# EasyEDA schematic SCH_pcb-try-1_2025-03-21.json
TITLE: Sheet_1; REV: 1.0; Date: 2025-03-08; Sheet: 1/1; Drawn By: amiragh; Company: Your Company
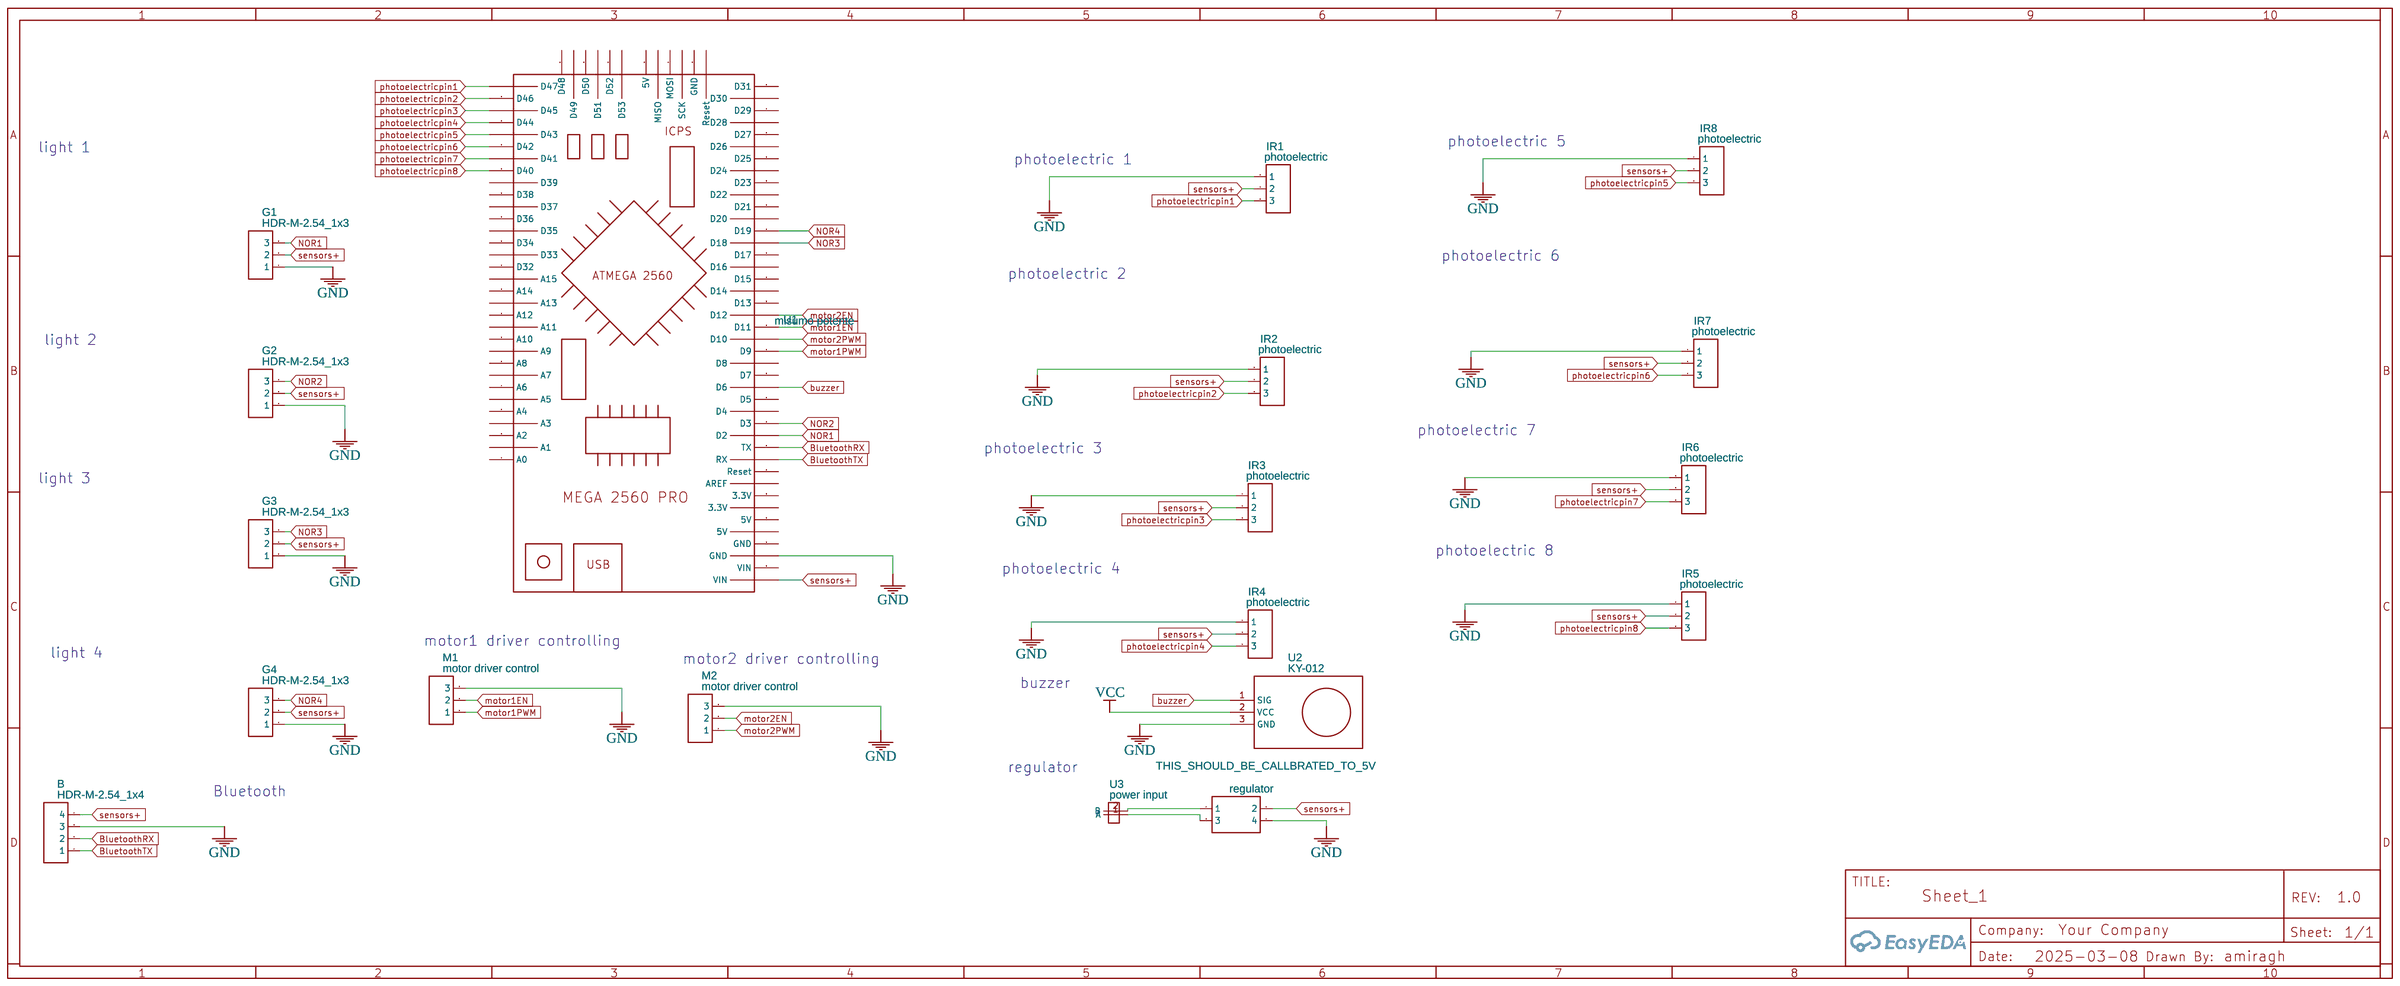
[diagram p0: schematic sheet]

## Parts
B  HDR-M-2.54_1x4  [HDR-M-2.54_1X4]
G1  HDR-M-2.54_1x3  [HDR-M-2.54_1X3]
G2  HDR-M-2.54_1x3  [HDR-M-2.54_1X3]
G3  HDR-M-2.54_1x3  [HDR-M-2.54_1X3]
G4  HDR-M-2.54_1x3  [HDR-M-2.54_1X3]
IR1  photoelectric  [HDR-M-2.54_1X3]
IR2  photoelectric  [HDR-M-2.54_1X3]
IR3  photoelectric  [HDR-M-2.54_1X3]
IR4  photoelectric  [HDR-M-2.54_1X3]
IR5  photoelectric  [HDR-M-2.54_1X3]
IR6  photoelectric  [HDR-M-2.54_1X3]
IR7  photoelectric  [HDR-M-2.54_1X3]
IR8  photoelectric  [HDR-M-2.54_1X3]
M1  motor driver control  [HDR-M-2.54_1X3]
M2  motor driver control  [HDR-M-2.54_1X3]
THIS_SHOULD_BE_CALLBRATED_TO_5V  regulator  [HDR-M-2.54_2X2]
U1  misumo potente  [ARDUINO MEGA 2560 PRO]
U2  KY-012  [KY012]
U3  power input  [2 PIN FIXED TERMINAL BLOCK]

## Library data of the parts
B = HDR-M-2.54_1x4: Supplier Part: C124378; Supplier: LCSC; Contributor: LCEDA_Lib
G1-G4 IR1-IR8 M1 M2 = HDR-M-2.54_1x3: Supplier Part: C180248; Supplier: LCSC; Contributor: LCEDA_Lib
THIS_SHOULD_BE_CALLBRATED_TO_5V = HDR-M-2.54_2x2: Supplier Part: C66690; Supplier: LCSC; Contributor: LCEDA_Lib
U1 = misumo potente: Manufacturer Part: Arduino Mega 2560 Pro Mini; link: https://www.arduino.cc; Contributor: Mauricio Placito Lopez
U2 = KY-012: Contributor: Андрей Кошевой
U3 = SCHLIB_2-Pin-Fixed-Terminal-Blocks-2.54-mm_2025-03-11: Manufacturer: Phoenix Contact; Manufacturer Part: 1725656; Supplier: Mouser; Supplier Part: 651-1725656; link: https://www.mouser.in/ProductDetail/Phoenix-Contact/1725656?qs=Ul7CXFMnlWWQeccayYbRmw%3D%3D; Contributor: sm.rial

## Nets
GND: B.3 G1.1 G2.1 G3.1 G4.1 IR1.1 IR2.1 IR3.1 IR4.1 IR5.1 IR6.1 IR7.1 IR8.1 M1.3 M2.3 THIS_SHOULD_BE_CALLBRATED_TO_5V.4 U1.84(GND) U2.3(GND)
VCC: U2.2(VCC)
BluetoothRX: B.2 U1.75(TX)
BluetoothTX: B.1 U1.76(RX)
buzzer: U1.70(D6) U2.1(SIG)
motor1EN: M1.2 U1.65(D11)
motor1PWM: M1.1 U1.67(D9)
motor2EN: M2.2 U1.64(D12)
motor2PWM: M2.1 U1.66(D10)
NOR1: G1.3 U1.74(D2)
NOR2: G2.3 U1.73(D3)
NOR3: G3.3 U1.58(D18)
NOR4: G4.3 U1.57(D19)
photoelectricpin1: IR1.3 U1.32(D47)
photoelectricpin2: IR2.3 U1.31(D46)
photoelectricpin3: IR3.3 U1.30(D45)
photoelectricpin4: IR4.3 U1.29(D44)
photoelectricpin5: IR8.3 U1.28(D43)
photoelectricpin6: IR7.3 U1.27(D42)
photoelectricpin7: IR6.3 U1.26(D41)
photoelectricpin8: IR5.3 U1.25(D40)
sensors+: B.4 G1.2 G2.2 G3.2 G4.2 IR1.2 IR2.2 IR3.2 IR4.2 IR5.2 IR6.2 IR7.2 IR8.2 THIS_SHOULD_BE_CALLBRATED_TO_5V.2 U1.86(VIN)
Net-(THIS_SHOULD_BE_CALLBRATED_TO_5V-1): THIS_SHOULD_BE_CALLBRATED_TO_5V.1 U3.2(B)
Net-(THIS_SHOULD_BE_CALLBRATED_TO_5V-3): THIS_SHOULD_BE_CALLBRATED_TO_5V.3 U3.1(A)

Not connected (* = marked no-connect by the designer): U1 1(A0) 2(A1) 3(A2) 4(A3) 5(A4) 6(A5) 7(A6) 8(A7) 9(A8) 10(A9) 11(A10) 12(A11) 13(A12) 14(A13) 15(A14) 16(A15) 17(D32) 18(D33) 19(D34) 20(D35) 21(D36) 22(D37) 23(D38) 24(D39) 33(D48) 34(D49) 35(D50) 36(D51) 37(D52) 38(D53) 39(5V) 40(MISO) 41(MOSI) 42(SCK) 43(GND) 44(Reset) 45(D31) 46(D30) 47(D29) 48(D28) 49(D27) 50(D26) 51(D25) 52(D24) 53(D23) 54(D22) 55(D21) 56(D20) 59(D17) 60(D16) 61(D15) 62(D14) 63(D13) 68(D8) 69(D7) 71(D5) 72(D4) 77(Reset) 78(AREF) 79(3.3V) 80(3.3V) 81(5V) 82(5V) 83(GND) 85(VIN)

## Notes on the sheet
- light 1
- photoelectric 5
- photoelectric 1
- photoelectric 6
- photoelectric 2
- light 2
- photoelectric 7
- photoelectric 3
- light 3
- photoelectric 8
- photoelectric 4
- motor1 driver controlling
- light 4
- motor2 driver controlling
- buzzer
- regulator
- Bluetooth
